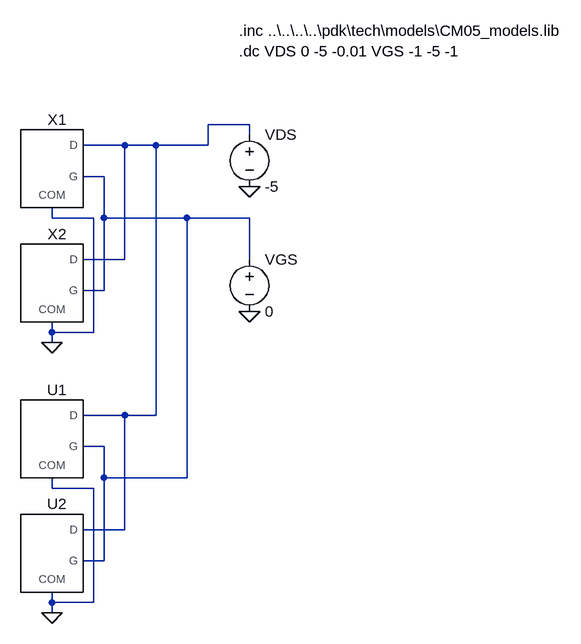
[diagram p0: schematic Unidad_P_Prueba.asc]
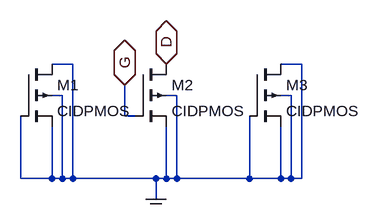
[diagram p1: sub-circuit unidad_p.asc]
Unidad_P_Prueba.asc, the LTspice schematic file:
Version 4.1
SHEET 1 1152 804
WIRE 528 32 464 32
WIRE 528 48 528 32
WIRE 336 64 272 64
WIRE 384 64 336 64
WIRE 464 64 464 32
WIRE 464 64 384 64
WIRE 304 112 272 112
WIRE 224 176 224 160
WIRE 288 176 224 176
WIRE 304 176 304 112
WIRE 432 176 304 176
WIRE 528 176 432 176
WIRE 336 240 336 64
WIRE 336 240 272 240
WIRE 528 240 528 176
WIRE 304 288 304 176
WIRE 304 288 272 288
WIRE 224 352 224 336
WIRE 288 352 288 176
WIRE 288 352 224 352
WIRE 224 368 224 352
WIRE 336 480 272 480
WIRE 384 480 384 64
WIRE 384 480 336 480
WIRE 304 528 272 528
WIRE 304 576 304 528
WIRE 432 576 432 176
WIRE 432 576 304 576
WIRE 224 592 224 576
WIRE 288 592 224 592
WIRE 336 656 336 480
WIRE 336 656 272 656
WIRE 304 704 304 576
WIRE 304 704 272 704
WIRE 224 768 224 752
WIRE 288 768 288 592
WIRE 288 768 224 768
WIRE 224 784 224 768
FLAG 224 368 0
FLAG 528 128 0
FLAG 528 320 0
FLAG 224 784 0
SYMBOL Unidad_P 224 96 R0
SYMATTR InstName X1
SYMBOL Unidad_P_Lay 224 512 R0
SYMATTR InstName U1
SYMBOL Unidad_P_Lay 224 688 R0
SYMATTR InstName U2
SYMBOL voltage 528 32 R0
WINDOW 123 0 0 Left 0
WINDOW 39 0 0 Left 0
SYMATTR InstName VDS
SYMATTR Value -5
SYMBOL voltage 528 224 R0
WINDOW 123 0 0 Left 0
WINDOW 39 0 0 Left 0
SYMATTR InstName VGS
SYMATTR Value 0
SYMBOL Unidad_P 224 272 R0
SYMATTR InstName X2
TEXT 512 -112 Left 2 !.inc ..\\..\\..\\..\\pdk\\tech\\models\\CM05_models.lib\n.dc VDS 0 -5 -0.01 VGS -1 -5 -1

unidad_p.asc, the sub-circuit schematic file:
Version 4.1
SHEET 1 880 680
WIRE 96 128 64 128
WIRE 448 128 416 128
WIRE 80 176 64 176
WIRE 256 176 240 176
WIRE 432 176 416 176
WIRE 176 208 176 160
WIRE 192 208 176 208
WIRE 16 304 16 208
WIRE 64 304 64 224
WIRE 64 304 16 304
WIRE 80 304 80 176
WIRE 80 304 64 304
WIRE 96 304 96 128
WIRE 96 304 80 304
WIRE 224 304 96 304
WIRE 240 304 240 224
WIRE 240 304 224 304
WIRE 256 304 256 176
WIRE 256 304 240 304
WIRE 368 304 368 208
WIRE 368 304 256 304
WIRE 416 304 416 224
WIRE 416 304 368 304
WIRE 432 304 432 176
WIRE 432 304 416 304
WIRE 448 304 448 128
WIRE 448 304 432 304
WIRE 224 336 224 304
FLAG 240 128 D
IOPIN 240 128 BiDir
FLAG 176 160 G
IOPIN 176 160 BiDir
FLAG 224 336 COM
IOPIN 224 336 BiDir
SYMBOL pmos4 16 128 R0
SYMATTR InstName M1
SYMATTR Value CIDPMOS
SYMATTR Value2 l=10u w=100u
SYMBOL pmos4 192 128 R0
SYMATTR InstName M2
SYMATTR Value CIDPMOS
SYMATTR Value2 l=10u w=100u
SYMBOL pmos4 368 128 R0
SYMATTR InstName M3
SYMATTR Value CIDPMOS
SYMATTR Value2 l=10u w=100u

The netlist it stands for:
* Unidad_P_Prueba.asc
X§X1 N001 N002 0 unidad_p
X§U1 N001 N002 0 Unidad_P  ; pins D G COM
X§U2 N001 N002 0 Unidad_P  ; pins D G COM
VDS N001 0 -5
VGS N002 0 0
X§X2 N001 N002 0 unidad_p

* block symbol definitions
.subckt unidad_p D G COM
M1 COM COM COM COM CIDPMOS l=10u w=100u
M2 D G COM COM CIDPMOS l=10u w=100u
M3 COM COM COM COM CIDPMOS l=10u w=100u
.ends unidad_p

.model NMOS NMOS
.model PMOS PMOS
.lib standard.mos
.inc ..\..\..\..\pdk\tech\models\CM05_models.lib
.dc VDS 0 -5 -0.01 VGS -1 -5 -1
.backanno
.end